# Altium schematic sheet clock_led_dual_switch.SchDoc: Dual anode switch
size 290 x 209 mm; Author: chs; SheetNumber: 2; SheetTotal: 3
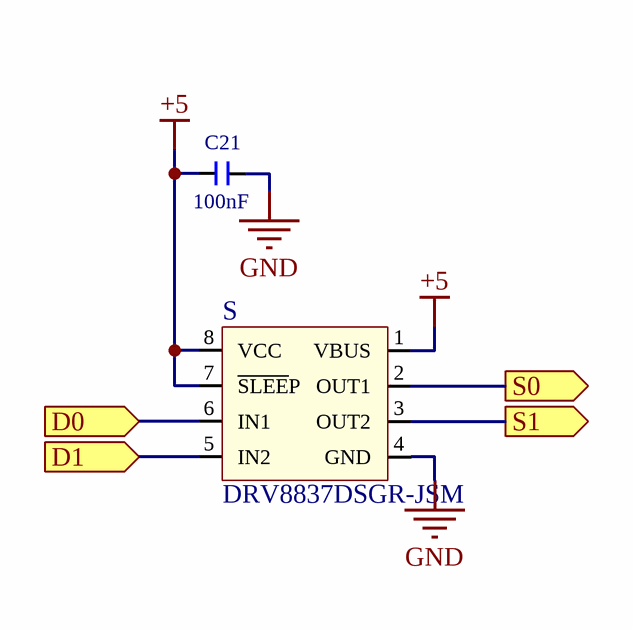
[diagram p0: clock_led_dual_switch.SchDoc]

## Parts
C21  100nF  [CAP_0402]
S  DRV8837DSGR-JSM  [DFN-8-2x2-TP]

## Ports
D0 (in), D1 (in), S0 (out), S1 (out)

## Nets
+5: C21.1 S.1(VBUS) S.7(~{SLEE}P) S.8(VCC)
GND: C21.2 S.4(GND)
D0: S.6(IN1) ; port D0
D1: S.5(IN2) ; port D1
S0: S.2(OUT1) ; port S0
S1: S.3(OUT2) ; port S1

## Library data of the parts
C21 = CAP_0402_100nF: Ceramic capacitor 0402; Value: 100nF; JLCPCB: ????
S = DRV8837DSGR-JSM: JLCPCB: C22447132